# Altium project MC50.PrjPcb (part 2 of 2)

## Sheet MC50_Pwr_MotDrv.SchDoc
size A3
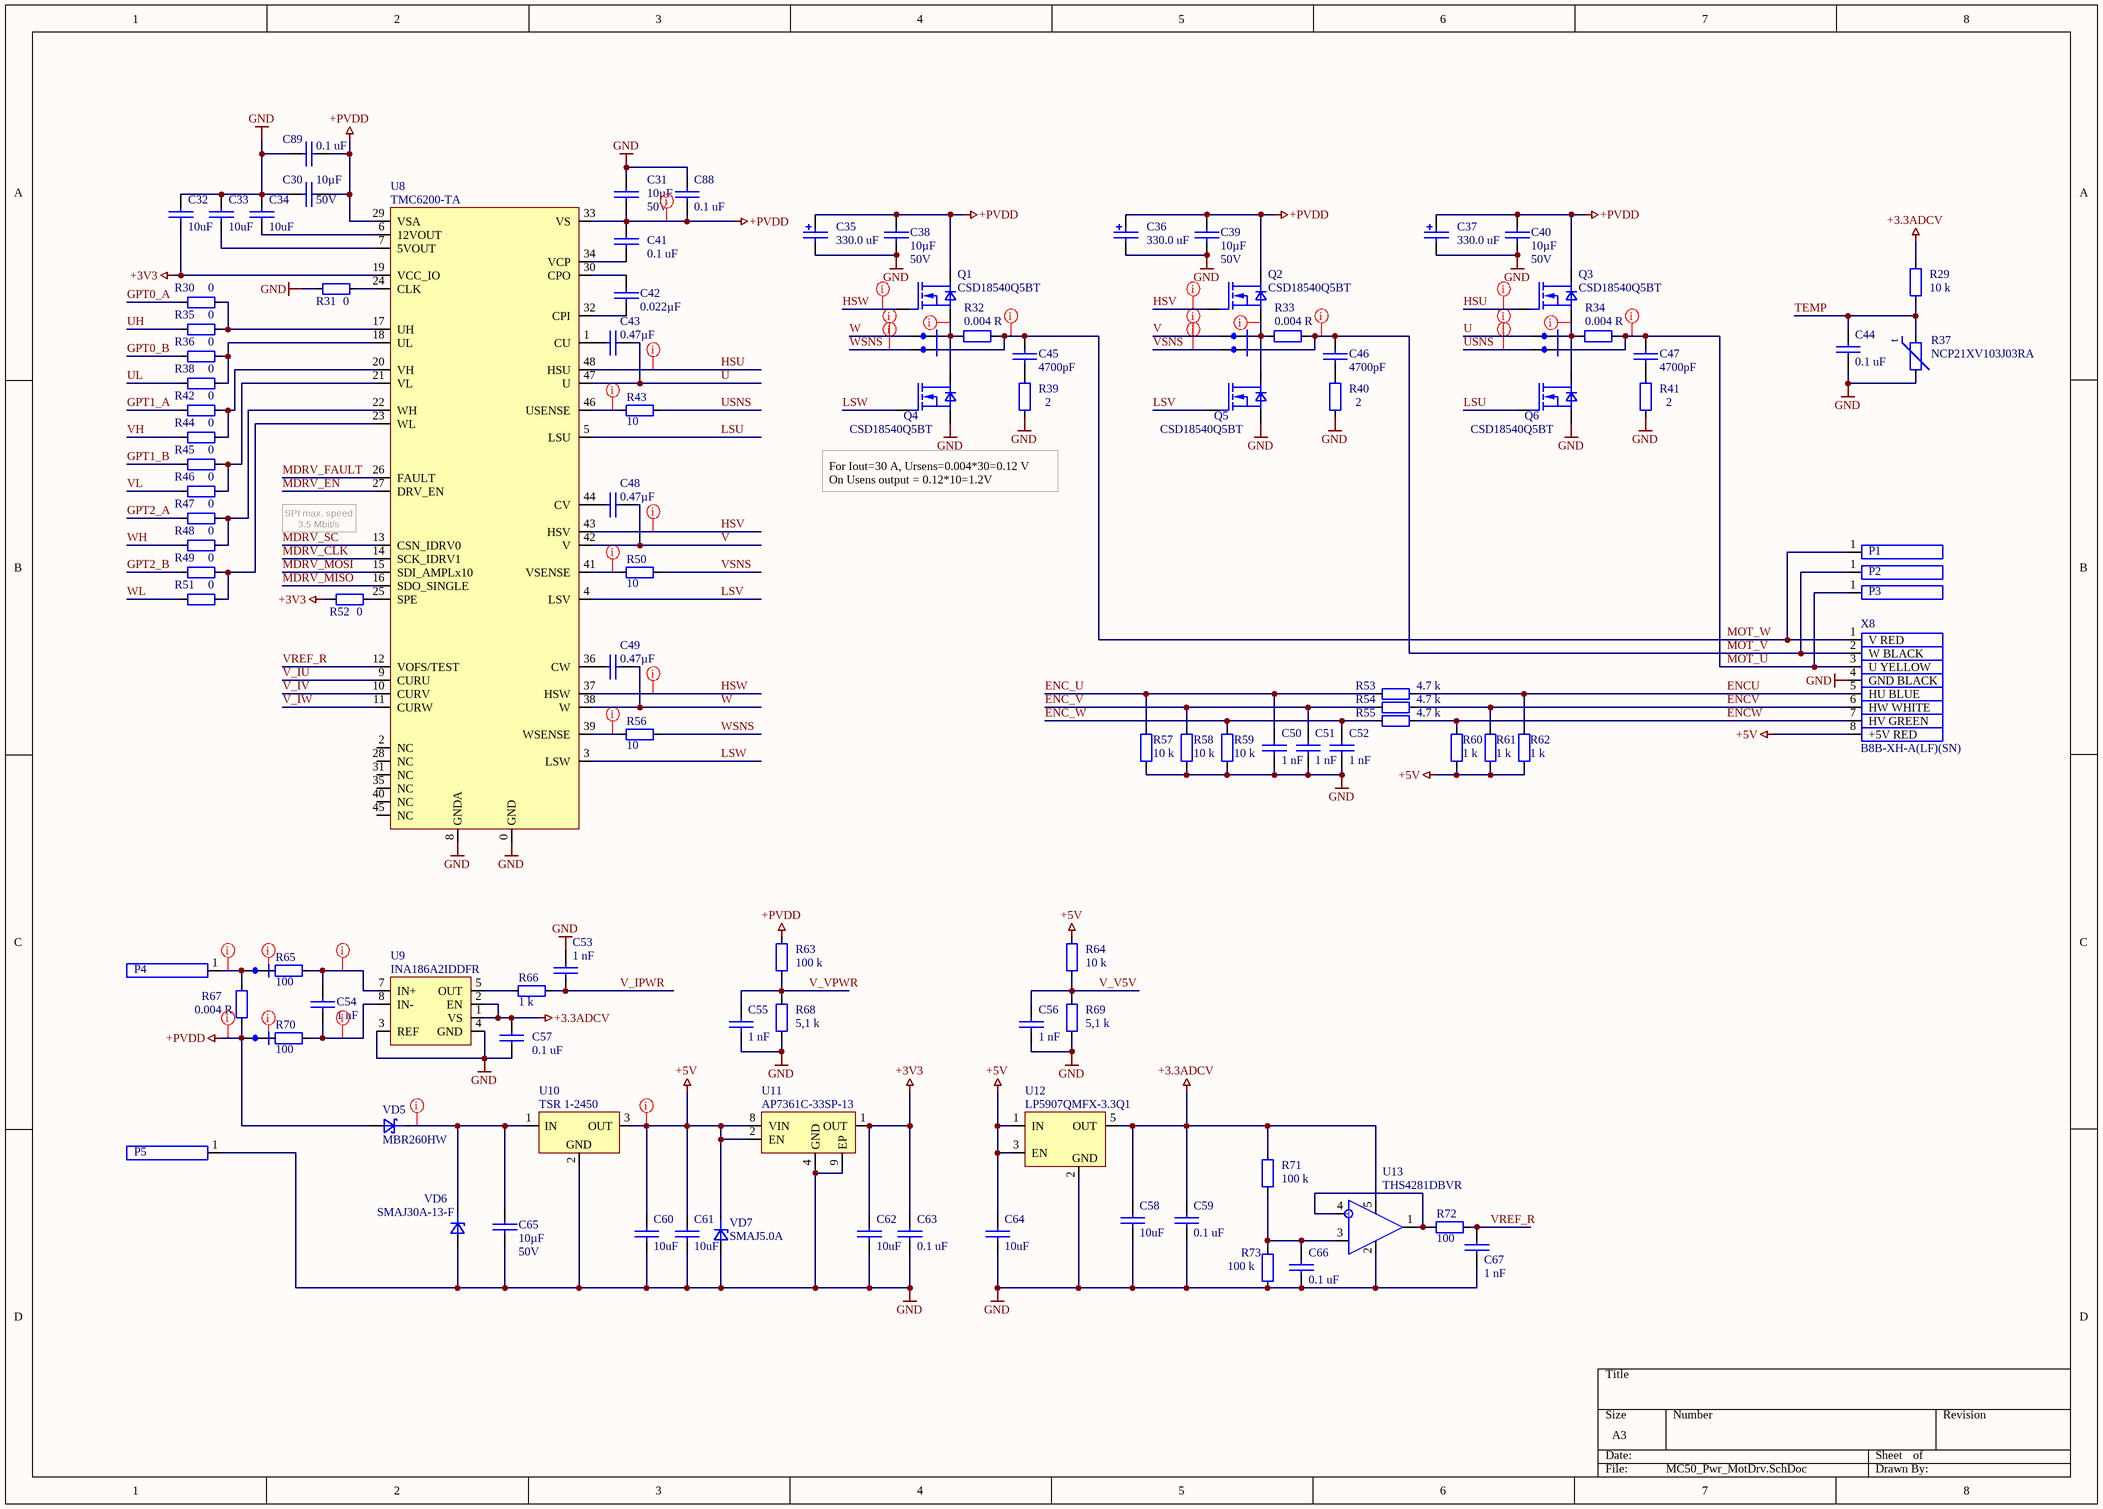
[diagram p2: MC50_Pwr_MotDrv.SchDoc]

### Parts
B1  Current shunt net tie 0.4 mm  [Current shunt net tie 0.4 mm]  (value not drawn)  (net tie, no BOM)
B2  Current shunt net tie 0.4 mm  [Current shunt net tie 0.4 mm]  (value not drawn)  (net tie, no BOM)
B3  Current shunt net tie 0.4 mm  [Current shunt net tie 0.4 mm]  (value not drawn)  (net tie, no BOM)
B4  Current shunt net tie 0.4 mm  [Current shunt net tie 0.4 mm]  (value not drawn)  (net tie, no BOM)
B5  Current shunt net tie 0.4 mm  [Current shunt net tie 0.4 mm]  (value not drawn)  (net tie, no BOM)
B6  Current shunt net tie 0.4 mm  [Current shunt net tie 0.4 mm]  (value not drawn)  (net tie, no BOM)
B7  Current shunt net tie 0.4 mm  [Current shunt net tie 0.4 mm]  (value not drawn)  (net tie, no BOM)
B8  Current shunt net tie 0.4 mm  [Current shunt net tie 0.4 mm]  (value not drawn)  (net tie, no BOM)
C30  value 10µF  Voltage - Rated: 50V  [1210 CAP]  (hidden comment: GCM32EC71H106KA03K)
C31  value 10µF  Voltage - Rated: 50V  [1210 CAP]  (hidden comment: GCM32EC71H106KA03K)
C32  value 10uF  [1608[0603]]  (hidden comment: GRM188R61E106KA73D)
C33  value 10uF  [1608[0603]]  (hidden comment: GRM188R61E106KA73D)
C34  value 10uF  [1608[0603]]  (hidden comment: GRM188R61E106KA73D)
C35  value 330.0 uF  [UUD1V331MNL1GS]  (hidden comment: EEE-FT1H331AP)
C36  value 330.0 uF  [UUD1V331MNL1GS]  (hidden comment: EEE-FT1H331AP)
C37  value 330.0 uF  [UUD1V331MNL1GS]  (hidden comment: EEE-FT1H331AP)
C38  value 10µF  Voltage - Rated: 50V  [1210 CAP]  (hidden comment: GCM32EC71H106KA03K)
C39  value 10µF  Voltage - Rated: 50V  [1210 CAP]  (hidden comment: GCM32EC71H106KA03K)
C40  value 10µF  Voltage - Rated: 50V  [1210 CAP]  (hidden comment: GCM32EC71H106KA03K)
C41  value 0.1 uF  [1608[0603]]  (hidden comment: CL10B104KA8NNND)
C42  value 0.022µF  [0603 CAP]  (hidden comment: 06035C223KAT4A)
C43  value 0.47µF  [0603 CAP]  (hidden comment: Capacitor)
C44  value 0.1 uF  [1608[0603]]  (hidden comment: CL10B104KA8NNND)
C45  value 4700pF  [0805 CAP]  (hidden comment: Capacitor)
C46  value 4700pF  [0805 CAP]  (hidden comment: Capacitor)
C47  value 4700pF  [0805 CAP]  (hidden comment: Capacitor)
C48  value 0.47µF  [0603 CAP]  (hidden comment: Capacitor)
C49  value 0.47µF  [0603 CAP]  (hidden comment: Capacitor)
C50  value 1 nF  [0603 CAP]  (hidden comment: CC0603JRX7R9BB102)
C51  value 1 nF  [0603 CAP]  (hidden comment: CC0603JRX7R9BB102)
C52  value 1 nF  [0603 CAP]  (hidden comment: CC0603JRX7R9BB102)
C53  value 1 nF  [0603 CAP]  (hidden comment: CC0603JRX7R9BB102)
C54  value 1 nF  [0603 CAP]  (hidden comment: CC0603JRX7R9BB102)
C55  value 1 nF  [0603 CAP]  (hidden comment: CC0603JRX7R9BB102)
C56  value 1 nF  [0603 CAP]  (hidden comment: CC0603JRX7R9BB102)
C57  value 0.1 uF  [1608[0603]]  (hidden comment: CL10B104KA8NNND)
C58  value 10uF  [1608[0603]]  (hidden comment: GRM188R61E106KA73D)
C59  value 0.1 uF  [1608[0603]]  (hidden comment: CL10B104KA8NNND)
C60  value 10uF  [1608[0603]]  (hidden comment: GRM188R61E106KA73D)
C61  value 10uF  [1608[0603]]  (hidden comment: GRM188R61E106KA73D)
C62  value 10uF  [1608[0603]]  (hidden comment: GRM188R61E106KA73D)
C63  value 0.1 uF  [1608[0603]]  (hidden comment: CL10B104KA8NNND)
C64  value 10uF  [1608[0603]]  (hidden comment: GRM188R61E106KA73D)
C65  value 10µF  Voltage - Rated: 50V  [1210 CAP]  (hidden comment: GCM32EC71H106KA03K)
C66  value 0.1 uF  [1608[0603]]  (hidden comment: CL10B104KA8NNND)
C67  value 1 nF  [0603 CAP]  (hidden comment: CC0603JRX7R9BB102)
C88  value 0.1 uF  [1608[0603]]  (hidden comment: CL10B104KA8NNND)
C89  value 0.1 uF  [1608[0603]]  (hidden comment: CL10B104KA8NNND)
P1  Keystone 1212  [Keystone 1212]  (value not drawn)
P2  Keystone 1212  [Keystone 1212]  (value not drawn)
P3  Keystone 1212  [Keystone 1212]  (value not drawn)
P4  Keystone 1212  [Keystone 1212]  (value not drawn)
P5  Keystone 1212  [Keystone 1212]  (value not drawn)
Q1  CSD18540Q5BT  [SO8FL Universal Footprint]
Q2  CSD18540Q5BT  [SO8FL Universal Footprint]
Q3  CSD18540Q5BT  [SO8FL Universal Footprint]
Q4  CSD18540Q5BT  [SO8FL Universal Footprint]
Q5  CSD18540Q5BT  [SO8FL Universal Footprint]
Q6  CSD18540Q5BT  [SO8FL Universal Footprint]
R29  value 10 k  [0603]  (hidden comment: Resistor)
R30  value 0  [0603]  (hidden comment: Resistor)
R31  value 0  [0603]  (hidden comment: Resistor)
R32  value 0.004 R  [CSNL2512 CURR SENS]  (hidden comment: CSNL2512FT4L00)
R33  value 0.004 R  [CSNL2512 CURR SENS]  (hidden comment: CSNL2512FT4L00)
R34  value 0.004 R  [CSNL2512 CURR SENS]  (hidden comment: CSNL2512FT4L00)
R35  value 0  [0603]  (hidden comment: Resistor)
R36  value 0  [0603]  (hidden comment: Resistor)
R37  NCP21XV103J03RA  [0805]
R38  value 0  [0603]  (hidden comment: Resistor)
R39  value 2  [0805]  (hidden comment: Resistor)
R40  value 2  [0805]  (hidden comment: Resistor)
R41  value 2  [0805]  (hidden comment: Resistor)
R42  value 0  [0603]  (hidden comment: Resistor)
R43  value 10  [0603]  (hidden comment: ERJ-3EKF10R0V)
R44  value 0  [0603]  (hidden comment: Resistor)
R45  value 0  [0603]  (hidden comment: Resistor)
R46  value 0  [0603]  (hidden comment: Resistor)
R47  value 0  [0603]  (hidden comment: Resistor)
R48  value 0  [0603]  (hidden comment: Resistor)
R49  value 0  [0603]  (hidden comment: Resistor)
R50  value 10  [0603]  (hidden comment: ERJ-3EKF10R0V)
R51  value 0  [0603]  (hidden comment: Resistor)
R52  value 0  [0603]  (hidden comment: Resistor)
R53  value 4.7 k  [0603]  (hidden comment: Resistor)
R54  value 4.7 k  [0603]  (hidden comment: Resistor)
R55  value 4.7 k  [0603]  (hidden comment: Resistor)
R56  value 10  [0603]  (hidden comment: ERJ-3EKF10R0V)
R57  value 10 k  [0603]  (hidden comment: Resistor)
R58  value 10 k  [0603]  (hidden comment: Resistor)
R59  value 10 k  [0603]  (hidden comment: Resistor)
R60  value 1 k  [0603]  (hidden comment: Resistor)
R61  value 1 k  [0603]  (hidden comment: Resistor)
R62  value 1 k  [0603]  (hidden comment: Resistor)
R63  value 100 k  [0603]  (hidden comment: Resistor)
R64  value 10 k  [0603]  (hidden comment: Resistor)
R65  value 100  [0603]  (hidden comment: Resistor)
R66  value 1 k  [0603]  (hidden comment: Resistor)
R67  value 0.004 R  [CSNL2512 CURR SENS]  (hidden comment: CSNL2512FT4L00)
R68  value 5,1 k  [0603]  (hidden comment: Resistor)
R69  value 5,1 k  [0603]  (hidden comment: Resistor)
R70  value 100  [0603]  (hidden comment: Resistor)
R71  value 100 k  [0603]  (hidden comment: Resistor)
R72  value 100  [0603]  (hidden comment: Resistor)
R73  value 100 k  [0603]  (hidden comment: Resistor)
U8  TMC6200-TA  [TQFP48-EP]
U9  INA186A2IDDFR  [TSOT-23-8 TI]
U10  TSR 1-2450  [TSR 1 Traco Power]
U11  AP7361C-33SP-13  [SOIC-8 EDP]
U12  LP5907QMFX-3.3Q1  [SOT23-5]
U13  THS4281DBVR  [SOT23-5]
VD5  MBR260HW  [SOD-123]
VD6  SMAJ30A-13-F  [SMA]
VD7  SMAJ5.0A  [SMA]
X8  B8B-XH-A(LF)(SN)  [B8B-XH-A]

### Nets
+3.3ADCV: C57.2 C58.1 C59.2 R29.2 R71.2 U9.1(VS) U9.2(EN) U12.5(OUT) U13.5(V+)
+3V3: C32.2 C62.1 C63.1 R52.1 U8.19(VCC_IO) U11.1(OUT)
+5V: C60.1 C61.1 C64.1 R60.1 R61.1 R62.1 R64.2 U10.3(OUT) U11.2(EN) U11.8(VIN) U12.1(IN) U12.3(EN) VD7.1 X8.8(+5V_RED)
+PVDD: B8.2 C30.2 C31.2 C35.1 C36.1 C37.1 C38.1 C39.1 C40.1 C41.2 C88.1 C89.1 Q1.3(D) Q2.3(D) Q3.3(D) R63.2 R67.1 U8.29(VSA) U8.33(VS) VD5.2(A)
GND: C30.1 C31.1 C32.1 C33.1 C34.1 C35.2 C36.2 C37.2 C38.2 C39.2 C40.2 C44.1 C50.2 C51.2 C52.2 C53.1 C55.2 C56.2 C57.1 C58.2 C59.1 C60.2 C61.2 C62.2 C63.2 C64.2 C65.1 C66.1 C67.2 C88.2 C89.2 P5.1 Q4.2(S) Q5.2(S) Q6.2(S) R31.1 R37.1 R39.1 R40.1 R41.1 R57.1 R58.1 R59.1 R68.1 R69.1 R73.1 U8.0(GND) U8.8(GNDA) U9.3(REF) U9.4(GND) U10.2(GND) U11.4(GND) U11.9(EP) U12.2(GND) U13.2(GND) VD6.2 VD7.2 X8.4(GND_BLACK)
ENC_U: C50.1 R53.2 R57.2
ENC_V: C51.1 R54.2 R58.2
ENC_W: C52.1 R55.2 R59.2
ENCU: R53.1 R62.2 X8.5(HU_BLUE)
ENCV: R54.1 R61.2 X8.6(HW_WHITE)
ENCW: R55.1 R60.2 X8.7(HV_GREEN)
GPT0_A: R30.1
GPT0_B: R36.1
GPT1_A: R42.1
GPT1_B: R45.1
GPT2_A: R47.1
GPT2_B: R49.1
HSU: Q3.1(G) U8.48(HSU)
HSV: Q2.1(G) U8.43(HSV)
HSW: Q1.1(G) U8.37(HSW)
LSU: Q6.1(G) U8.5(LSU)
LSV: Q5.1(G) U8.4(LSV)
LSW: Q4.1(G) U8.3(LSW)
MDRV_CLK: U8.14(SCK_IDRV1)
MDRV_EN: U8.27(DRV_EN)
MDRV_FAULT: U8.26(FAULT)
MDRV_MISO: U8.16(SDO_SINGLE)
MDRV_MOSI: U8.15(SDI_AMPLx10)
MDRV_SC: U8.13(CSN_IDRV0)
MOT_U: B6.1 C47.1 P3.1 R34.2 X8.3(U_YELLOW)
MOT_V: B5.1 C46.1 P2.1 R33.2 X8.2(W_BLACK)
MOT_W: B4.1 C45.1 P1.1 R32.2 X8.1(V_RED)
TEMP: C44.2 R29.1 R37.2
U: B3.2 C43.2 U8.47(U)
UH: R35.1
UL: R38.1
USNS: B6.2 R43.2
V: B2.2 C48.2 U8.42(V)
V_IPWR: C53.2 R66.2
V_IU: U8.9(CURU)
V_IV: U8.10(CURV)
V_IW: U8.11(CURW)
V_V5V: C56.1 R64.1 R69.2
V_VPWR: C55.1 R63.1 R68.2
VH: R44.1
VL: R46.1
VREF_R: C67.1 R72.1 U8.12(VOFS/TEST)
VSNS: B5.2 R50.2
W: B1.2 C49.2 U8.38(W)
WH: R48.1
WL: R51.1
WSNS: B4.2 R56.2
NetB1_1: B1.1 Q1.2(S) Q4.3(D) R32.1
NetB2_1: B2.1 Q2.2(S) Q5.3(D) R33.1
NetB3_1: B3.1 Q3.2(S) Q6.3(D) R34.1
NetB7_1: B7.1 R65.1
NetB7_2: B7.2 P4.1 R67.2
NetB8_1: B8.1 R70.2
NetC33_2: C33.2 U8.7(5VOUT)
NetC34_2: C34.2 U8.6(12VOUT)
NetC41_1: C41.1 U8.34(VCP)
NetC42_1: C42.1 U8.30(CPO)
NetC42_2: C42.2 U8.32(CPI)
NetC43_1: C43.1 U8.1(CU)
NetC45_2: C45.2 R39.2
NetC46_2: C46.2 R40.2
NetC47_2: C47.2 R41.2
NetC48_1: C48.1 U8.44(CV)
NetC49_1: C49.1 U8.36(CW)
NetC54_1: C54.1 R70.1 U9.8(IN-)
NetC54_2: C54.2 R65.2 U9.7(IN+)
NetC65_2: C65.2 U10.1(IN) VD5.1(C) VD6.1
NetC66_2: C66.2 R71.1 R73.2 U13.3(IN+)
NetR30_2: R30.2 R35.2 U8.17(UH)
NetR31_2: R31.2 U8.24(CLK)
NetR36_2: R36.2 R38.2 U8.18(UL)
NetR42_2: R42.2 R44.2 U8.20(VH)
NetR43_1: R43.1 U8.46(USENSE)
NetR45_2: R45.2 R46.2 U8.21(VL)
NetR47_2: R47.2 R48.2 U8.22(WH)
NetR49_2: R49.2 R51.2 U8.23(WL)
NetR50_1: R50.1 U8.41(VSENSE)
NetR52_2: R52.2 U8.25(SPE)
NetR56_1: R56.1 U8.39(WSENSE)
NetR66_1: R66.1 U9.5(OUT)
NetR72_2: R72.2 U13.1(OUT) U13.4(IN-)

Not connected (* = marked no-connect by the designer): U8 2(NC) 28(NC) 31(NC) 35(NC) 40(NC) 45(NC)

### Layout directives
net class 24V; net class W: HSW, MOT_W, NetB1_1, W, WSNS
net class 24V; net class V: HSV, MOT_V, NetB2_1, V, VSNS
net class 24V; net class U: HSU, MOT_U, NetB3_1, U, USNS
net class 5V: +5V
net class 24V: +PVDD, HSU, HSV, HSW, NetC54_1, NetC54_2, NetC65_2, NetR43_1, NetR50_1, NetR56_1
net class 24V; net class PWR: +PVDD, NetB7_1, NetB7_2, NetB8_1

### Notes on the sheet
- For Iout=30 A, Ursens=0.004*30=0.12 V
  On Usens output = 0.12*10=1.2V
- (near U8) SPI max. speed 3.5 Mbit/s
- (in symbol NCP21XV103J03RA) t

### Library data of the parts
C30 C31 C38-C40 C65 = GCM32EC71H106KA03K: 10µF, ±10%, 50V, X7S, 1210 (3225 Metric), -55°C ~ 125°C, -, Automotive; Manufacturer: Murata Electronics North America; PartNum: 490-14535-1-ND; Part Number: GCM32EC71H106KA03K; Distributor: Digi-Key; PartName: GCM32EC71H106KA03K; Price: 0.64430; Tolerance: ±10%; Temperature Coefficient: X7S; Operating Temperature: -55°C ~ 125°C; Features: -; Package / Case: 1210 (3225 Metric)
C32-C34 C58 C60-C62 C64 = GRM188R61E106KA73D: 10 µF ±10% 25V Ceramic Capacitor X5R 0603 (1608 Metric), -55°C ~ 85°C; Manufacturer: Murata Electronics; PartNum: 490-18214-1-ND; Tolerance: ±10%; Price: 0.41$; Distributor: Digi-Key; Voltage: 25V; PartName: GRM188R61E106KA73D
C35-C37 = EEE-FT1H331AP: 330 uF, 50V, 120 mOhm @ 100kHz, 585 mA, 10x10, -50...+105 C; Manufacturer: Panasonic Electronic Components; PartNum: PCE5026CT-ND; Tolerance: ±20%; Voltage: 50 V; Distributor: Digi-Key; PartName: EEE-FT1H331AP
C41 C44 C57 C59 C63 C66 C88 C89 = 0603B104K500CT: 0.1 µF ±10% 50V Ceramic Capacitor X7R 0603 (1608 Metric), / -55°C ~ 125°C; Manufacturer: Walsin Technology Corporation; PartNum: 1292-1643-1-ND; Tolerance: +-10%; Distributor: Digi-Key; PartName: 0603B104K500CT; Voltage: 50V; Price: 0.0062 Euro
C42 = 06035C223KAT4A: 0.022µF, ±10%, 50V, X7R, 0603 (1608 Metric), -55°C ~ 125°C, -, General Purpose; Manufacturer: AVX Corporation; PartNum: 478-7019-1-ND; Part Number: 06035C223KAT4A; Distributor: Digi-Key; PartName: 06035C223KAT4A; Price: 0.04380; Tolerance: ±10%; Voltage - Rated: 50V; Temperature Coefficient: X7R; Operating Temperature: -55°C ~ 125°C; Features: -; Package / Case: 0603 (1608 Metric); Supplier 1: Farnell; Supplier Part Number 1: 3288928
C43 C48 C49 = CL10F474ZB8NNNC: 0.47µF, -20%, +80%, 50V, Y5V (F), 0603 (1608 Metric), -30°C ~ 85°C, -, General Purpose; Manufacturer: Samsung Electro-Mechanics; PartNum: 1276-2377-1-ND; Temperature Coefficient: Y5V (F); Part Number: CL10F474ZB8NNNC; Distributor: Digi-Key; PartName: CL10F474ZB8NNNC; Price: 0.04580; Tolerance: -20%, +80%; Voltage - Rated: 50V; Operating Temperature: -30°C ~ 85°C; Features: -; Package / Case: 0603 (1608 Metric)
C45-C47 = CL21B472KCANNNC: 4700pF, ±10%, 100V, X7R, 0805 (2012 Metric), -55°C ~ 125°C, -, General Purpose; Manufacturer: Samsung Electro-Mechanics; PartNum: 1276-2524-1-ND; Voltage - Rated: 100V; Part Number: CL21B472KCANNNC; Distributor: Digi-Key; PartName: CL21B472KCANNNC; Price: 0.11000; Tolerance: ±10%; Temperature Coefficient: X7R; Operating Temperature: -55°C ~ 125°C; Features: -; Package / Case: 0805 (2012 Metric)
C50-C56 C67 = CC0603JRX7R9BB102: 1000pF, ±5%, 50V, X7R, 0603 (1608 Metric), -55°C ~ 125°C, -, General Purpose; Manufacturer: Yageo; PartNum: 311-3361-1-ND; Voltage - Rated: 50V; Part Number: CC0603JRX7R9BB102; Distributor: Digi-Key; PartName: CC0603JRX7R9BB102; Price: 0.01920; Tolerance: ±5%; Temperature Coefficient: X7R; Operating Temperature: -55°C ~ 125°C; Features: -; Package / Case: 0603 (1608 Metric)
P1-P5 = Keystone_1212: (4.75mm) Quick Connect Male Solder Connector Non-Insulated; Manufacturer: Keystone Electronics; PartNum: 36-1212-ND; Distributor: Digi-Key; PartName: Keystone 1212
Q1-Q6 = CSD18540Q5BT: MOSFET N-CH, 100 A, 60V, Vgs=±20V, 1.8 mOhm, 41nC @ 10V, 5-DFN (5x6), -55°C ~ 150°C; Manufacturer: Texas Instruments; PartNum: 296-37963-1-ND; Price: 2.32 Euro; Distributor: Digi-Key; PartName: CSD18540Q5BT; Supplier 1: Digi-Key; Supplier Part Number 1: 296-37963-1-ND
R29 R64 = RNCF0603BTE10K0: 10 kOhms, ±0.1%, 0.1W, 1/10W, Thin Film, ±25ppm/°C, 0603 (1608 Metric), -55°C ~ 155°C, Automotive AEC-Q200; Manufacturer: Stackpole Electronics Inc; PartNum: RNCF0603BTE10K0CT-ND; Voltage: 75V; Distributor: Digi-Key; Price: 0.259; Tolerance: ±0.1%; PartName: RNCF0603BTE10K0; Part Number: RNCF0603BTE10K0; Temperature Coefficient: ±25ppm/°C; Operating Temperature: -55°C ~ 155°C; Power (Watts): 0.1W, 1/10W; Features: Automotive AEC-Q200; Package / Case: 0603 (1608 Metric)
R30 R31 R35 R36 R38 R42 R44-R49 R51 R52 = RMCF0603ZT0R00: 0 Ohms, 0.1W, 1/10W, Thick Film, 0603 (1608 Metric), -55°C ~ 155°C, Automotive AEC-Q200; Manufacturer: Stackpole Electronics Inc.; PartNum: RMCF0603ZT0R00CT-ND; Distributor: Digi-Key; Price: 0.00690; Tolerance: -; Voltage: -; PartName: RMCF0603ZT0R00; Part Number: RMCF0603ZT0R00; Temperature Coefficient: -; Operating Temperature: -55°C ~ 155°C; Power (Watts): 0.1W, 1/10W; Features: Automotive AEC-Q200; Package / Case: 0603 (1608 Metric)
R32-R34 R67 = CSNL2512FT4L00: Curr.sens.res. 0.004 OHM, 2W, 1% , ±50ppm/°C, 2512 (6432 Metric); Manufacturer: Stackpole Electronics Inc.; PartNum: CSNL2512FT4L00CT-ND; Distributor: Digi-Key; Tolerance: ±1%; PartName: CSNL2512FT4L00
R37 = NCP21XV103J03RA: Thermistor 10k, 0805, NTC; Manufacturer: Murata; PartNum: 490-2456-1-ND; Distributor: Digi-Key; Value: 10 K; PartName: NCP21XV103J03RA
R39-R41 = CRCW08052R00FKEAC: 2 Ohms, ±1%, 0.125W, 1/8W, Thick Film, ±100ppm/°C, 0805 (2012 Metric), -55°C ~ 155°C, -; Manufacturer: Vishay Dale; PartNum: 541-4155-1-ND; Voltage: 150V; Distributor: Digi-Key; Price: 0.01950; Tolerance: ±1%; PartName: CRCW08052R00FKEAC; Part Number: CRCW08052R00FKEAC; Temperature Coefficient: ±100ppm/°C; Operating Temperature: -55°C ~ 155°C; Power (Watts): 0.125W, 1/8W; Features: -; Package / Case: 0805 (2012 Metric)
R43 R50 R56 = ERJ-3EKF10R0V: 10 Ohms, ±1%, 0.1W, 1/10W, Thick Film, ±100ppm/°C, 0603 (1608 Metric), -55°C ~ 155°C, Automotive AEC-Q200; Manufacturer: Panasonic Electronic Components; PartNum: P10.0HCT-ND; Voltage: 75V; Distributor: Digi-Key; Price: 0.02570; Tolerance: ±1%; PartName: ERJ-3EKF10R0V; Part Number: ERJ-3EKF10R0V; Temperature Coefficient: ±100ppm/°C; Operating Temperature: -55°C ~ 155°C; Power (Watts): 0.1W, 1/10W; Features: Automotive AEC-Q200; Package / Case: 0603 (1608 Metric); Supplier 1: Farnell; Supplier Part Number 1: 2397504
R53-R55 = RMCF0603FT4K70: 4.7 kOhms, ±1%, 0.1W, 1/10W, Thick Film, ±100ppm/°C, 0603 (1608 Metric), -55°C ~ 155°C, Automotive AEC-Q200; Manufacturer: Stackpole Electronics Inc.; PartNum: RMCF0603FT4K70CT-ND; Voltage: 75V; Distributor: Digi-Key; Price: 0.00690; Tolerance: ±1%; PartName: RMCF0603FT4K70; Part Number: RMCF0603FT4K70; Temperature Coefficient: ±100ppm/°C; Operating Temperature: -55°C ~ 155°C; Power (Watts): 0.1W, 1/10W; Features: Automotive AEC-Q200; Package / Case: 0603 (1608 Metric)
R57-R59 = CR0603-FX-1002GLF: 10 kOhms, ±1%, 0.1W, 1/10W, Thick Film, ±100ppm/°C, 0603 (1608 Metric), -55°C ~ 155°C, Moisture Resistant; Manufacturer: Bourns Inc.; PartNum: CR0603-FX-1002GLFCT-ND; Voltage: 75V; Distributor: Digi-Key; Price: 0.00860; Tolerance: ±1%; PartName: CR0603-FX-1002GLF; Part Number: CR0603-FX-1002GLF; Temperature Coefficient: ±100ppm/°C; Operating Temperature: -55°C ~ 155°C; Power (Watts): 0.1W, 1/10W; Features: Moisture Resistant; Package / Case: 0603 (1608 Metric)
R60-R62 R66 = RMCF0603FG1K00: 1 kOhms, ±1%, 0.1W, 1/10W, Thick Film, ±100ppm/°C, 0603 (1608 Metric), -55°C ~ 155°C, Automotive AEC-Q200; Manufacturer: Stackpole Electronics Inc.; PartNum: RMCF0603FG1K00CT-ND; Voltage: 75V; Distributor: Digi-Key; Price: 0.00690; Tolerance: ±1%; PartName: RMCF0603FG1K00; Part Number: RMCF0603FG1K00; Temperature Coefficient: ±100ppm/°C; Operating Temperature: -55°C ~ 155°C; Power (Watts): 0.1W, 1/10W; Features: Automotive AEC-Q200; Package / Case: 0603 (1608 Metric)
R63 R71 R73 = RG1608P-104-B-T5: 100 kOhms, ±0.1%, 0.1W, 1/10W, Thin Film, ±25ppm/°C, 0603 (1608 Metric), -55°C ~ 155°C, Anti-Sulfur, Automotive AEC-Q200; Manufacturer: Susumu; PartNum: RG16P100KBCT-ND; Voltage: 75V; Distributor: Digi-Key; Price: 0.259; Tolerance: ±0.1%; PartName: RG1608P-104-B-T5; Part Number: RG1608P-104-B-T5; Temperature Coefficient: ±25ppm/°C; Operating Temperature: -55°C ~ 155°C; Power (Watts): 0.1W, 1/10W; Features: Anti-Sulfur, Automotive AEC-Q200; Package / Case: 0603 (1608 Metric)
R65 R70 R72 = RMCF0603FT100R: 100 Ohms, ±1%, 0.1W, 1/10W, Thick Film, ±100ppm/°C, 0603 (1608 Metric), -55°C ~ 155°C, Automotive AEC-Q200; Manufacturer: Stackpole Electronics Inc.; PartNum: RMCF0603FT100RCT-ND; Voltage: 75V; Distributor: Digi-Key; Price: 0.00690; Tolerance: ±1%; PartName: RMCF0603FT100R; Part Number: RMCF0603FT100R; Temperature Coefficient: ±100ppm/°C; Operating Temperature: -55°C ~ 155°C; Power (Watts): 0.1W, 1/10W; Features: Automotive AEC-Q200; Package / Case: 0603 (1608 Metric)
R68 R69 = TNPW06035K10BEEA: 5,1 kOhms, ±0.1%, 0.125W, 1/8W, Thin Film, ±25ppm/°C, 0603 (1608 Metric), -55°C ~ 155°C, Anti-Sulfur, Automotive AEC-Q200, Moisture Resistant; Manufacturer: Vishay Dale; PartNum: 541-2035-1-ND; Voltage: 75V; Distributor: Digi-Key; Price: 0.4; Tolerance: ±0.1%; PartName: TNPW06035K10BEEA; Part Number: TNPW06035K10BEEA; Temperature Coefficient: ±25ppm/°C; Operating Temperature: -55°C ~ 155°C; Power (Watts): 0.125W, 1/8W; Features: Anti-Sulfur, Automotive AEC-Q200, Moisture Resistant; Package / Case: 0603 (1608 Metric)
U8 = TMC6200-TA: Three Phase Automotive Gate Driver with Three Integrated Current Shunt Amplifiers and Voltage Regulator, PHP0048G; Manufacturer: Trinamic Motion Control GmbH; PartNum: 1460-1384-ND; Distributor: Digi-Key; Price: 2.6; PartName: TMC6200-TA
U9 = INA186A2IDDFR: Current Sense Amplifier, 50V/V, 37 kHz, Vcm=–0.2 V to +40 V, Vcc=1.7V ~ 5.5V, , Icc=48µA, -40°C ~ 125°C, TSOT-23-8; Manufacturer: Texas Instruments; PartNum: 296-INA186A2IDDFRCT-ND; Price: 1.1; Distributor: Digi-Key; PartName: INA186A2IDDFR
U10 = TSR 1-2450: Linear Regulator Replacement DC DC Converter 5W, 5V, 1A, 6.5V - 36V Input, -40°C ~ 85°C; Manufacturer: Traco Power; PartNum: 1951-2747-ND; Distributor: Digi-Key; price: 3.9$; PartName: TSR 1-2450
U11 = AP7361C-33SP-13: LDO, 3.3 V, 1A, 0.36V@1A, Vin=6V max, -40..+85C, 8-SO-EP; PartNum: AP7361C-33SP-13DICT-ND; Manufacturer: Diodes Incorporated; Distributor: Digi-Key; Price: 0.56$; PartName: AP7361C-33SP-13; Supplier 1: Digi-Key; Supplier Part Number 1: AP7361C-33SP-13DICT-ND
U12 = LP5907QMFX-3.3Q1: LDO 3.3 V, 250 mA, Vin < 5.5V, Iq < 12uA, -40..+125 C, SOT23-5; Manufacturer: Texas Instruments; PartNum: 296-40365-1-ND; Distributor: Digi-Key; PartName: LP5907QMFX-3.3Q1
U13 = THS4281DBVR: Voltage Feedback Amplifier 1 Circuit Rail-to-Rail SOT-23-5; Manufacturer: Texas Instruments; PartNum: 296-39224-1-ND; Distributor: Digi-Key; PartName: THS4281DBVR
VD5 = APD240KDTR-G1: Diode Schottky  60V, 2A, 660mV @ 2A, -, SOD-123, -55°C ~ 150°C; Manufacturer: Diodes Incorporated; PartNum: 1655-MBR260HWCT-ND; Voltage - DC Reverse (Vr) (Max): 40V; Voltage - Forward (Vf) (Max) @ If: 500mV @ 2A; Speed: Fast Recovery =< 500ns, > 200mA (Io); Current - Reverse Leakage @ Vr: 500µA @ 40V; PartName: MBR260HW; Part Number: APD240KDTR-G1; Distributor: Digi-Key; Price: 0.19370; Current - Average Rectified (Io): 2A; Reverse Recovery Time (trr): -; Operating Temperature: -65°C ~ 125°C; Package / Case: SOD-123
VD6 = SMAJ30A-13-F: 48.4V Clamp 8.3A Ipp Tvs Diode Surface Mount SMA,; Manufacturer: Diodes Incorporated; PartNum: SMAJ30A-FDICT-ND; Voltage: 30 V; Distributor: Digi-Key; Price: 0.18$; PartName: SMAJ30A-13-F
VD7 = SMAJ5.0A: 9.2V Clamp 43.5A Ipp Tvs Diode Surface Mount SMA, -55°C ~ 150°C (TJ); Manufacturer: Littelfuse Inc.; PartNum: SMAJ5.0ALFCT-ND; Voltage: 30 V; Distributor: Digi-Key; Price: 0.18$; PartName: SMAJ5.0A
X8 = B8B-XH-A(LF)(SN): CONN HEADER XH TOP 8POS 2.5MM; Manufacturer: JST Sales America Inc.; PartNum: 455-2251-ND; Distributor: Digi-Key; PartName: B8B-XH-A(LF)(SN)

## Sheet MC50_BLE.SchDoc
size A3
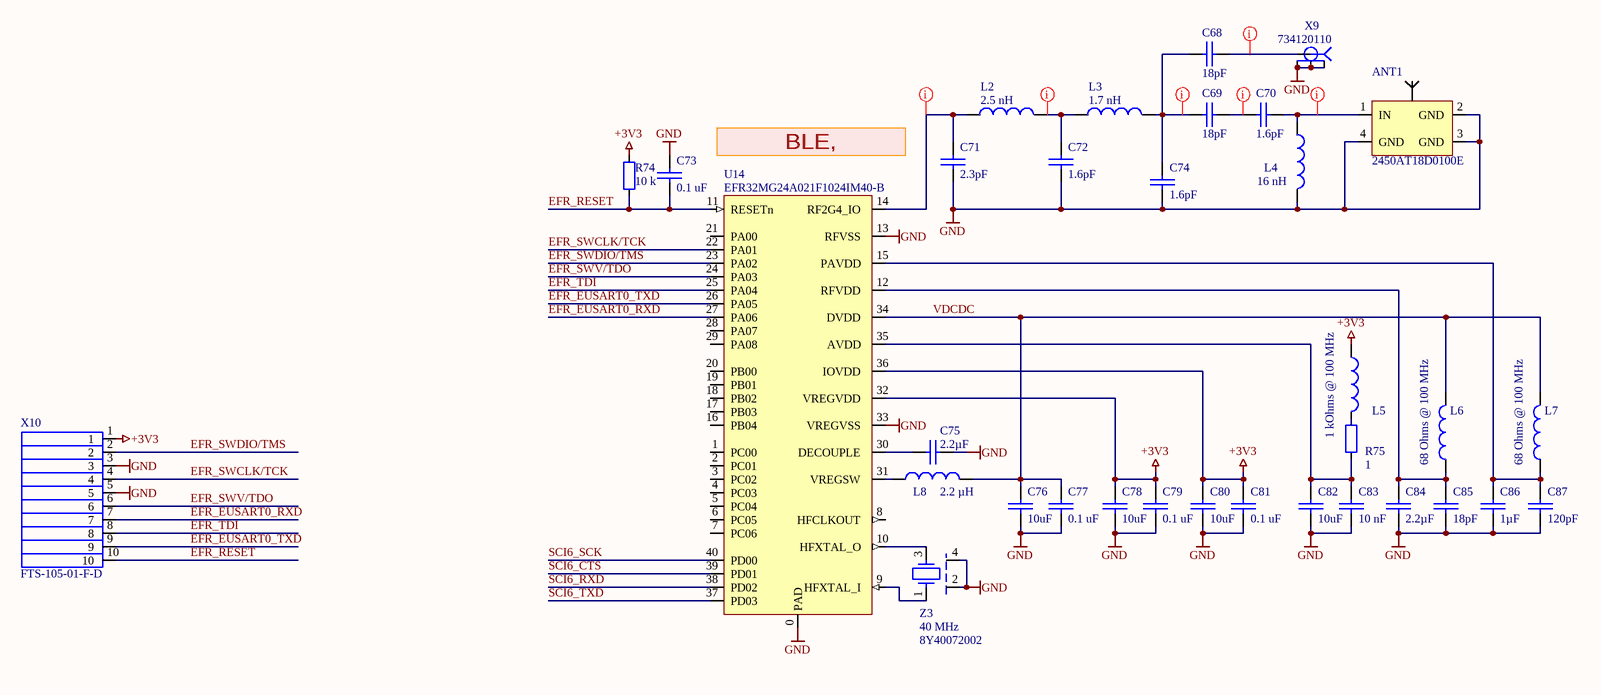
[diagram p3: MC50_BLE.SchDoc]

### Parts
ANT1  2450AT18D0100E  [2450AT18D0100E_JOT]
C68  value 18pF  [0402 CAP]  (hidden comment: Capacitor)
C69  value 18pF  [0402 CAP]  (hidden comment: Capacitor)
C70  value 1.6pF  [0402 CAP]  (hidden comment: Capacitor)
C71  value 2.3pF  [0402 CAP]  (hidden comment: Capacitor)
C72  value 1.6pF  [0402 CAP]  (hidden comment: Capacitor)
C73  value 0.1 uF  [1608[0603]]  (hidden comment: CL10B104KA8NNND)
C74  value 1.6pF  [0402 CAP]  (hidden comment: Capacitor)
C75  value 2.2µF  [0603 CAP]  (hidden comment: GRM188R71A225KE15D)
C76  value 10uF  [1608[0603]]  (hidden comment: GRM188R61E106KA73D)
C77  value 0.1 uF  [1608[0603]]  (hidden comment: CL10B104KA8NNND)
C78  value 10uF  [1608[0603]]  (hidden comment: GRM188R61E106KA73D)
C79  value 0.1 uF  [1608[0603]]  (hidden comment: CL10B104KA8NNND)
C80  value 10uF  [1608[0603]]  (hidden comment: GRM188R61E106KA73D)
C81  value 0.1 uF  [1608[0603]]  (hidden comment: CL10B104KA8NNND)
C82  value 10uF  [1608[0603]]  (hidden comment: GRM188R61E106KA73D)
C83  value 10 nF  [0603 CAP]  (hidden comment: Capacitor)
C84  value 2.2µF  [0603 CAP]  (hidden comment: GRM188R71A225KE15D)
C85  value 18pF  [0603 CAP]  (hidden comment: Capacitor)
C86  value 1µF  [0603 CAP]  (hidden comment: Capacitor)
C87  value 120pF  [0603 CAP]  (hidden comment: Capacitor)
L2  value 2.5 nH  [INDC1005-0402]  (hidden comment: ATFC-0402-2N5B-T)
L3  value 1.7 nH  [INDC1005-0402]  (hidden comment: ATFC-0402-1N7B-T)
L4  value 16 nH  [INDC1005-0402]  (hidden comment: 0402HP-160EJTS)
L5  value 1 kOhms @ 100 MHz  [0603]  (hidden comment: HZ0603B102R-10)
L6  value 68 Ohms @ 100 MHz  [0603]  (hidden comment: ILBB0603ER680V)
L7  value 68 Ohms @ 100 MHz  [0603]  (hidden comment: ILBB0603ER680V)
L8  value 2.2 µH  [0603]  (hidden comment: LQM18PZ2R2MFHD)
R74  value 10 k  [0603]  (hidden comment: Resistor)
R75  value 1  [0603]  (hidden comment: Resistor)
U14  EFR32MG24A021F1024IM40-B  [QFN40 Silabs]
X9  734120110  [0734120110]
X10  FTS-105-01-F-D  [FTS-105-01-F-D]
Z3  8Y40072002  value 40 MHz  [4-SMD 2.00mm x 1.60mm]

### Nets
+3V3: C78.1 C79.2 C80.1 C81.2 L5.1 R74.1 U14.32(VREGVDD) U14.36(IOVDD) X10.1
GND: ANT1.2(GND) ANT1.3(GND) ANT1.4(GND) C71.2 C72.2 C73.2 C74.2 C75.2 C76.2 C77.1 C78.2 C79.1 C80.2 C81.1 C82.2 C83.2 C84.1 C85.2 C86.2 C87.2 L4.2 U14.0(PAD) U14.13(RFVSS) U14.33(VREGVSS) X9.2 X9.3 X9.4 X10.3 X10.5 Z3.2 Z3.4
EFR_EUSART0_RXD: U14.27(PA06) X10.7
EFR_EUSART0_TXD: U14.26(PA05) X10.9
EFR_RESET: C73.1 R74.2 U14.11(RESETn) X10.10
EFR_SWCLK/TCK: U14.22(PA01) X10.4
EFR_SWDIO/TMS: U14.23(PA02) X10.2
EFR_SWV/TDO: U14.24(PA03) X10.6
EFR_TDI: U14.25(PA04) X10.8
SCI6_CTS: U14.39(PD01)
SCI6_RXD: U14.38(PD02)
SCI6_SCK: U14.40(PD00)
SCI6_TXD: U14.37(PD03)
VDCDC: C76.1 C77.2 L6.2 L7.2 L8.2 U14.34(DVDD)
NetANT1_1: ANT1.1(IN) C70.2 L4.1
NetC68_1: C68.1 C69.1 C74.1 L3.2
NetC68_2: C68.2 X9.1(Sig)
NetC69_2: C69.2 C70.1
NetC71_1: C71.1 L2.1 U14.14(RF2G4_IO)
NetC72_1: C72.1 L2.2 L3.1
NetC75_1: C75.1 U14.30(DECOUPLE)
NetC82_1: C82.1 C83.1 R75.1 U14.35(AVDD)
NetC84_2: C84.2 C85.1 L6.1 U14.12(RFVDD)
NetC86_1: C86.1 C87.1 L7.1 U14.15(PAVDD)
NetL5_2: L5.2 R75.2
NetL8_1: L8.1 U14.31(VREGSW)
NetU14_9: U14.9(HFXTAL_I) Z3.1
NetU14_10: U14.10(HFXTAL_O) Z3.3

Not connected (* = marked no-connect by the designer): U14 1(PC00_) 2(PC01_) 3(PC02_) 4(PC03_) 5(PC04_) 6(PC05_) 7(PC06_) 8(HFCLKOUT_) 16(PB04_) 17(PB03_) 18(PB02_) 19(PB01_) 20(PB00_) 21(PA00_) 28(PA07_) 29(PA08_)

### Layout directives
net class RF: NetANT1_1, NetC68_1, NetC68_2, NetC69_2, NetC71_1, NetC72_1

### Notes on the sheet
- BLE, IEE802.15.4

### Library data of the parts
ANT1 = 2450AT18D0100E: 2.4GHz Chip RF Antenna 2.4GHz ~ 2.5GHz 1.5dBi Solder Surface Mount; PartNum: 712-1573-1-ND; Manufacturer: Johanson Technology Inc.; PartName: 2450AT18D0100E; Distributor: Digi-Key
C68 C69 = CC0402JRNPO9BN180: 18pF, ±5%, 50V, C0G, NP0, 0402 (1005 Metric), -55°C ~ 125°C, -, General Purpose; Manufacturer: Yageo; PartNum: 311-1415-1-ND; Part Number: CC0402JRNPO9BN180; Distributor: Digi-Key; PartName: CC0402JRNPO9BN180; Price: 0.10000; Tolerance: ±5%; Voltage - Rated: 50V; Temperature Coefficient: C0G, NP0; Operating Temperature: -55°C ~ 125°C; Features: -; Package / Case: 0402 (1005 Metric)
C70 C72 C74 = CC0402BRNPO9BN1R6: 1.6pF, ±0.1pF, 50V, C0G, NP0, 0402 (1005 Metric), -55°C ~ 125°C, -, General Purpose; Manufacturer: Yageo; PartNum: 311-3702-1-ND; Part Number: CC0402BRNPO9BN1R6; Distributor: Digi-Key; PartName: CC0402BRNPO9BN1R6; Price: 0.10000; Tolerance: ±0.1pF; Voltage - Rated: 50V; Temperature Coefficient: C0G, NP0; Operating Temperature: -55°C ~ 125°C; Features: -; Package / Case: 0402 (1005 Metric)
C71 = 885392005009: 2.3pF, ±0.05pF, 50V, C0G, NP0, 0402 (1005 Metric), -55°C ~ 125°C, -, RF, Microwave, High Frequency; Manufacturer: Wurth Electronics Inc.; PartNum: 732-13234-1-ND; Part Number: 885392005009; Distributor: Digi-Key; PartName: 885392005009; Price: 0.15000; Tolerance: ±0.05pF; Voltage - Rated: 50V; Temperature Coefficient: C0G, NP0; Operating Temperature: -55°C ~ 125°C; Features: -; Package / Case: 0402 (1005 Metric)
C73 C77 C79 C81 = 0603B104K500CT: as C41 on sheet MC50_Pwr_MotDrv; Distributor: Digi-Key; PartName: 0603B104K500CT; Voltage: 50V; Price: 0.0062 Euro
C75 C84 = GRM188R71A225KE15D: 2.2µF, ±10%, 10V, X7R, 0603 (1608 Metric), -55°C ~ 125°C, -, General Purpose; Manufacturer: Murata Electronics North America; PartNum: 490-4520-1-ND; Part Number: GRM188R71A225KE15D; Distributor: Digi-Key; PartName: GRM188R71A225KE15D; Price: 0.18800; Tolerance: ±10%; Voltage - Rated: 10V; Temperature Coefficient: X7R; Operating Temperature: -55°C ~ 125°C; Features: -; Package / Case: 0603 (1608 Metric); Supplier 1: Farnell; Supplier Part Number 1: 2666507
C76 C78 C80 C82 = GRM188R61E106KA73D: as C32 on sheet MC50_Pwr_MotDrv; Tolerance: ±10%; Price: 0.41$; Distributor: Digi-Key; Voltage: 25V; PartName: GRM188R61E106KA73D
C83 = C1608C0G1H103J080AA: 10000pF, ±5%, 50V, C0G, NP0, 0603 (1608 Metric), -55°C ~ 125°C, Low ESL, General Purpose; Manufacturer: TDK Corporation; PartNum: 445-7404-1-ND; Part Number: C1608C0G1H103J080AA; Distributor: Digi-Key; PartName: C1608C0G1H103J080AA; Price: 0.15090; Tolerance: ±5%; Voltage - Rated: 50V; Temperature Coefficient: C0G, NP0; Operating Temperature: -55°C ~ 125°C; Features: Low ESL; Package / Case: 0603 (1608 Metric)
C85 = C0603C180K5GACTU: 18pF, ±10%, 50V, C0G, NP0, 0603 (1608 Metric), -55°C ~ 125°C, Low ESL, General Purpose; Manufacturer: KEMET; PartNum: 399-7866-1-ND; Part Number: C0603C180K5GACTU; Distributor: Digi-Key; PartName: C0603C180K5GACTU; Price: 0.03170; Tolerance: ±10%; Voltage - Rated: 50V; Temperature Coefficient: C0G, NP0; Operating Temperature: -55°C ~ 125°C; Features: Low ESL; Package / Case: 0603 (1608 Metric)
C86 = CL10A105KB8NNNC: 1µF, ±10%, 50V, X5R, 0603 (1608 Metric), -55°C ~ 85°C, -, General Purpose; Manufacturer: Samsung Electro-Mechanics; PartNum: 1276-1860-1-ND; Part Number: CL10A105KB8NNNC; Distributor: Digi-Key; PartName: CL10A105KB8NNNC; Price: 0.05980; Tolerance: ±10%; Voltage - Rated: 50V; Temperature Coefficient: X5R; Operating Temperature: -55°C ~ 85°C; Features: -; Package / Case: 0603 (1608 Metric)
C87 = CL10C121JB8NCNC: 120pF, ±5%, 50V, C0G, NP0, 0603 (1608 Metric), -55°C ~ 125°C, -, General Purpose; Manufacturer: Samsung Electro-Mechanics; PartNum: 1276-2180-1-ND; Part Number: CL10C121JB8NCNC; Distributor: Digi-Key; PartName: CL10C121JB8NCNC; Price: 0.01740; Tolerance: ±5%; Voltage - Rated: 50V; Temperature Coefficient: C0G, NP0; Operating Temperature: -55°C ~ 125°C; Features: -; Package / Case: 0603 (1608 Metric)
L2 = ATFC-0402-2N5B-T: 2.5 nH Unshielded Thin Film Inductor 440 mA 350mOhm Max 0402 (1005 Metric); Manufacturer: Abracon LLC; PartNum: 535-10366-1-ND; Tolerance: ±0.1nH; Distributor: Digi-Key; PartName: ATFC-0402-2N5B-T
L3 = ATFC-0402-1N7B-T: 1.7 nH Unshielded Thin Film Inductor 560 mA 250mOhm Max 0402 (1005 Metric); Manufacturer: Abracon LLC; PartNum: 535-10358-1-ND; Tolerance: ±0.1nH; Distributor: Digi-Key; PartName: ATFC-0402-1N7B-T
L4 = 0402HP-160EJTS: 16 nH Unshielded Drum Core, Wirewound Inductor 850 mA 130mOhm 0402 (1005 Metric); Manufacturer: Delta Electronics/Components; PartNum: 2035-1532-1-ND; Tolerance: 5%; Distributor: Digi-Key; PartName: 0402HP-160EJTS
L5 = HZ0603B102R-10: 1 kOhms @ 100 MHz 1 Power, Signal Line Ferrite Bead 0603 (1608 Metric) 200mA 600mOhm; Manufacturer: Laird-Signal Integrity Products; PartNum: 240-2378-1-ND; Distributor: Digi-Key; Price: 0.06$; PartName: HZ0603B102R-10
L6 L7 = ILBB0603ER680V: 68 Ohms @ 100 MHz 1 Ferrite Bead 0603 (1608 Metric) 200mA 100mOhm, -55°C ~ 125°C; Manufacturer: Murata Manufacturing; PartNum: 541-2605-1-ND; Distributor: Digi-Key; Price: 0.11; PartName: ILBB0603ER680V
L8 = LQM18PZ2R2MFHD: 2.2 µH Shielded Multilayer Inductor 700 mA 470mOhm Max 0603 (1608 Metric); Manufacturer: Murata Electronics; PartNum: 490-15982-1-ND; Tolerance: ±20%; Distributor: Digi-Key; Price: 0.2; PartName: LQM18PZ2R2MFHD
R74 = CR0603-FX-1002GLF: as R57 on sheet MC50_Pwr_MotDrv; Distributor: Digi-Key; Price: 0.00860; Tolerance: ±1%; PartName: CR0603-FX-1002GLF; Part Number: CR0603-FX-1002GLF; Temperature Coefficient: ±100ppm/°C; Operating Temperature: -55°C ~ 155°C; Power (Watts): 0.1W, 1/10W; Features: Moisture Resistant; Package / Case: 0603 (1608 Metric)
R75 = RCG06031R00FKEA: 1 Ohms, ±1%, 0.1W, 1/10W, Thick Film, ±100ppm/°C, 0603 (1608 Metric), -55°C ~ 155°C, -; Manufacturer: Vishay Dale; PartNum: 541-1776-1-ND; Voltage: 75V; Distributor: Digi-Key; Price: 0.04050; Tolerance: ±1%; PartName: RCG06031R00FKEA; Part Number: RCG06031R00FKEA; Temperature Coefficient: ±100ppm/°C; Operating Temperature: -55°C ~ 155°C; Power (Watts): 0.1W, 1/10W; Features: -; Package / Case: 0603 (1608 Metric)
U14 = EFR32MG24A021F1024IM40-B: IC RF TxRx + MCU Bluetooth Bluetooth v5.3 2.4GHz,  1024KB FLASH, 128KB RAM, 40-VFQFN Exposed Pad, -40°C ~ 125°C (TA); Manufacturer: Silicon Labs; PartNum: 336-EFR32MG24A021F1024IM40-B-ND; Distributor: Digi-Key; PartName: EFR32MG24A021F1024IM40-B; Price: 6$
X9 = 0734120110: U.FL (UMCC) Connector Receptacle, Male Pin 50 Ohm Surface Mount Solder; Manufacturer: Molex; PartNum: WM5587TR-ND; Distributor: Digi-Key; PartName: 0734120110
X10 = FTS-105-01-F-D: Board-To-Board Connector, Vertical, FTS Series, Through Hole, Header, 10, 1.27 mm; Manufacturer: SAMTEC; PartNum: 1928242; Distributor: Farnell; PartName: FTS-105-01-F-D
Z3 = 8Y40072002: 40 MHz Crystal 8pF 80 Ohms 4-SMD, No Lead, -20°C ~ 70°C; Manufacturer: TXC CORPORATION; PartNum: 887-8Y40072002CT-ND; Distributor: Digi-Key; PartName: 8Y40072002

## Nets that join several sheets
+3.3ADCV: MC50_Periph (L1.1 R4.2 R5.2 X2.1), MC50_Pwr_MotDrv (9 pins)
+3V3: MC50_CPU (X1.1), MC50_Periph (27 pins), MC50_Pwr_MotDrv (6 pins), MC50_BLE (9 pins)
+5V: MC50_Periph (8 pins), MC50_Pwr_MotDrv (14 pins)
GND: MC50_CPU (X1.3 X1.5), MC50_Periph (80 pins), MC50_Pwr_MotDrv (58 pins), MC50_BLE (31 pins)
BT1: MC50_CPU (U1.70), MC50_Periph (R16.1 SW1.A)
BT2: MC50_CPU (U1.69), MC50_Periph (R17.1 SW1.B)
BT3: MC50_CPU (U1.68), MC50_Periph (R18.1 SW1.4)
CAN_EN: MC50_CPU (U1.5), MC50_Periph (U3.6)
CAN_RX: MC50_CPU (U1.3), MC50_Periph (U3.4)
CAN_STB: MC50_CPU (U1.4), MC50_Periph (U3.14)
CAN_TX: MC50_CPU (U1.2), MC50_Periph (U3.1)
ENC_U: MC50_CPU (U1.76), MC50_Pwr_MotDrv (C50.1 R53.2 R57.2)
ENC_V: MC50_CPU (U1.77), MC50_Pwr_MotDrv (C51.1 R54.2 R58.2)
ENC_W: MC50_CPU (U1.78), MC50_Pwr_MotDrv (C52.1 R55.2 R59.2)
EXT_TEMP: MC50_CPU (U1.95), MC50_Periph (C7.1 R8.2)
GPT0_A: MC50_CPU (U1.17), MC50_Pwr_MotDrv (R30.1)
GPT0_B: MC50_CPU (U1.18), MC50_Pwr_MotDrv (R36.1)
GPT1_A: MC50_CPU (U1.6), MC50_Pwr_MotDrv (R42.1)
GPT1_B: MC50_CPU (U1.7), MC50_Pwr_MotDrv (R45.1)
GPT2_A: MC50_CPU (U1.56), MC50_Pwr_MotDrv (R47.1)
GPT2_B: MC50_CPU (U1.57), MC50_Pwr_MotDrv (R49.1)
LCD_BLK: MC50_CPU (U1.33), MC50_Periph (X11.8)
LCD_CS: MC50_CPU (U1.72), MC50_Periph (X11.7)
LCD_RS: MC50_CPU (U1.34), MC50_Periph (X11.6)
LCD_RST: MC50_CPU (U1.35), MC50_Periph (X11.5)
LED_CAN: MC50_CPU (U1.55), MC50_Periph (LED1.2)
LED_GR: MC50_CPU (U1.81), MC50_Periph (U5.2)
LED_RD: MC50_CPU (U1.80), MC50_Periph (U6.2)
LED_RS485: MC50_CPU (U1.58), MC50_Periph (LED2.2)
MDRV_CLK: MC50_CPU (U1.73), MC50_Periph (R26.1), MC50_Pwr_MotDrv (U8.14)
MDRV_EN: MC50_CPU (U1.54), MC50_Pwr_MotDrv (U8.27)
MDRV_FAULT: MC50_CPU (U1.1), MC50_Pwr_MotDrv (U8.26)
MDRV_MISO: MC50_CPU (U1.75), MC50_Pwr_MotDrv (U8.16)
MDRV_MOSI: MC50_CPU (U1.74), MC50_Periph (R27.2), MC50_Pwr_MotDrv (U8.15)
MDRV_SC: MC50_CPU (U1.71), MC50_Pwr_MotDrv (U8.13)
MISC: MC50_CPU (U1.94), MC50_Periph (C6.1 R10.2)
POS_SENS: MC50_CPU (U1.96), MC50_Periph (C8.1 R6.2)
RS485_DE: MC50_CPU (U1.59), MC50_Periph (U7.3)
RS485_RX: MC50_CPU (U1.66), MC50_Periph (U7.1)
RS485_TX: MC50_CPU (U1.65), MC50_Periph (U7.4)
S5_RESET: MC50_CPU (X1.10), MC50_Periph (C2.1 R3.1 U1.38)
SCI6_CTS: MC50_CPU (U1.41), MC50_BLE (U14.39)
SCI6_RXD: MC50_CPU (U1.44), MC50_BLE (U14.38)
SCI6_SCK: MC50_CPU (U1.42), MC50_BLE (U14.40)
SCI6_TXD: MC50_CPU (U1.43), MC50_BLE (U14.37)
SD_CLK: MC50_CPU (U1.19), MC50_Periph (uSD1.5)
SD_CMD: MC50_CPU (U1.20), MC50_Periph (uSD1.3)
SD_DAT0: MC50_CPU (U1.21), MC50_Periph (uSD1.7)
SD_DAT1: MC50_CPU (U1.22), MC50_Periph (uSD1.8)
SD_DAT2: MC50_CPU (U1.31), MC50_Periph (uSD1.1)
SD_DAT3: MC50_CPU (U1.32), MC50_Periph (uSD1.2)
SOUND: MC50_CPU (U1.84), MC50_Periph (C20.1)
TEMP: MC50_CPU (U1.85), MC50_Pwr_MotDrv (C44.2 R29.1 R37.2)
UH: MC50_CPU (U1.48), MC50_Pwr_MotDrv (R35.1)
UL: MC50_CPU (U1.49), MC50_Pwr_MotDrv (R38.1)
USBHS_STATE: MC50_CPU (U1.25), MC50_Periph (C4.2 R7.1 R9.2)
V_IPWR: MC50_CPU (U1.92), MC50_Pwr_MotDrv (C53.2 R66.2)
V_IU: MC50_CPU (U1.100), MC50_Pwr_MotDrv (U8.9)
V_IV: MC50_CPU (U1.99), MC50_Pwr_MotDrv (U8.10)
V_IW: MC50_CPU (U1.98), MC50_Pwr_MotDrv (U8.11)
V_V5V: MC50_CPU (U1.79), MC50_Pwr_MotDrv (C56.1 R64.1 R69.2)
V_VPWR: MC50_CPU (U1.93), MC50_Pwr_MotDrv (C55.1 R63.1 R68.2)
VH: MC50_CPU (U1.36), MC50_Pwr_MotDrv (R44.1)
VL: MC50_CPU (U1.37), MC50_Pwr_MotDrv (R46.1)
VREF_R: MC50_CPU (U1.97), MC50_Pwr_MotDrv (C67.1 R72.1 U8.12)
WH: MC50_CPU (U1.23), MC50_Pwr_MotDrv (R48.1)
WL: MC50_CPU (U1.24), MC50_Pwr_MotDrv (R51.1)

## Assembly variants
Base Variant: not fitted C68 P1 P2 P3 R45 R54 R55 R56 R57 R58 R59 R60 R61 R68 U5 U6 X4 X6